# EasyEDA Pro project LTC1569.eprj

# Schematic Schematic1
Board Name: Board1; Create Date: 2025-04-03; Page Name: P1; Project Name: LTC1569; Schematic Name: Schematic1; Update Date: 2025-04-23; Company: 嘉立创EDA; Page Size: A4; Version: V1.0
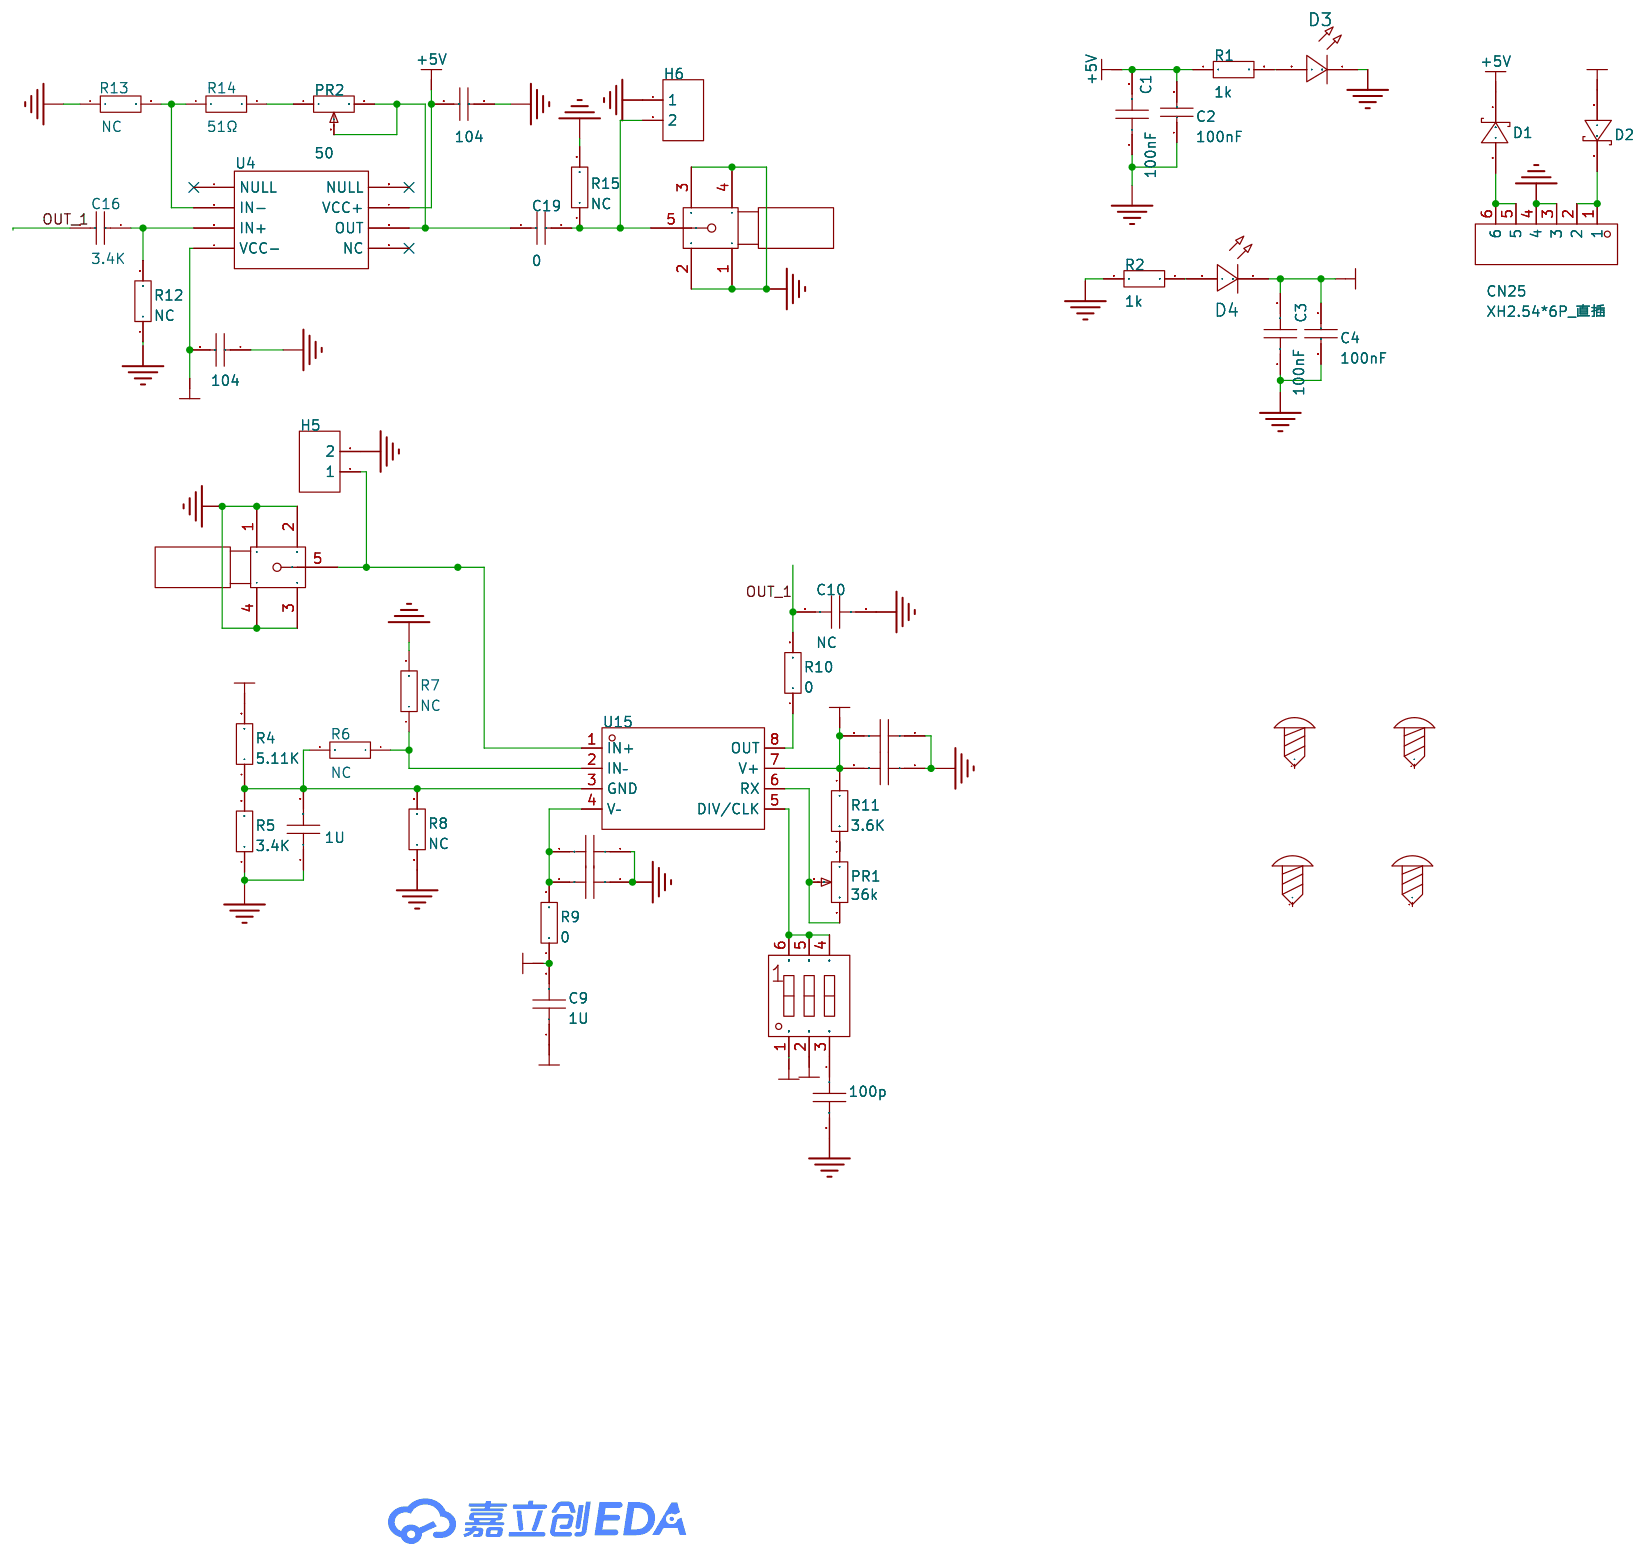
[diagram p0: schematic sheet]

## Parts
C1  100nF  [R0805]
C2  100nF  [C1210]
C3  100nF  [R0805]
C4  100nF  [C1210]
C6  1U  [R0805]
C7  100nF  [R0805]
C8  100nF  [R0805]
C9  1U  [R0805]
C10  NC  [R0805]
C11  100nF  [R0805]
C12  100nF  [R0805]
C14  100p  [R0805]
C16  3.4K  [R0805]
C17  104  [R0805]
C18  104  [R0805]
C19  0  [R0805]
CN25  XH2.54*6P_直插  [CONN-TH_XH2.54-6P]
D1  SD103AWS  [SOD-323_L1.8-W1.3-LS2.5-RD]
D2  SD103AWS  [SOD-323_L1.8-W1.3-LS2.5-RD]
D3  -  [LED_0805]
D4  -  [LED_0805]
H5  -  [HDR-TH_2P-P2.54-V-F]
H6  -  [HDR-TH_2P-P2.54-V-F]
PR1  36k  [R_3296]
PR2  50  [R_3296]
R1  1k  [R0805]
R2  1k  [R0805]
R4  5.11K  [R0805]
R5  3.4K  [R0805]
R6  NC  [R0805]
R7  NC  [R0805]
R8  NC  [R0805]
R9  0  [R0805]
R10  0  [R0805]
R11  3.6K  [R0805]
R12  NC  [R0805]
R13  NC  [R0805]
R14  51Ω  [R0805]
R15  NC  [R0805]
SCREW9  -  [M3螺丝]
SCREW10  -  [M3螺丝]
SCREW11  -  [M3螺丝]
SCREW12  -  [M3螺丝]
SW1  DSIC03LS-P  [SW-SMD_6P-L8.6-W6.2-P2.54-LS9.8]
U4  -  [THS4001CD]
U15  LTC1569IS8-6#TRPBF  [SO-8_L4.9-W3.9-P1.27-LS6.0-BL]
U16  -  [SMA]
U17  -  [SMA]

## Library data of the parts
C1 C3 C6-C12 C14 = CAP_0805: Supplier Footprint: 0805
C2 C4 = CL32B106KAJNNNE: 容值:10uF;精度:±10%;额定电压:25V;材质(温度系数):X7R;; LCSC Part Name: 10uF ±10% 25V; Supplier Part: C39232; Manufacturer: SAMSUNG(三星); Supplier Footprint: 1210; JLCPCB Part Class: 扩展库; Datasheet: https://atta.szlcsc.com/upload/public/pdf/source/20160218/1457707763339.pdf; Supplier: LCSC; Tolerance: ±10%; Voltage Rated: 25V; Temperature Coefficient: X7R
C16-C19 = CL21C101JBANNNC: 容值:100pF;精度:±5%;额定电压:50V;材质(温度系数):C0G;; LCSC Part Name: 100pF ±5% 50V; Supplier Part: C1790; Manufacturer: SAMSUNG(三星); Supplier Footprint: 0805; JLCPCB Part Class: 基础库; Datasheet: https://atta.szlcsc.com/upload/public/pdf/source/20160218/1457707763339.pdf; Supplier: LCSC; Tolerance: ±5%; Voltage Rated: 50V; Temperature Coefficient: C0G
CN25 = XH2.54*6P_直插: Supplier Part: C9900008614; Supplier Footprint: XH2.54_6P; JLCPCB Part Class: 扩展库; Supplier: LCSC
D1 D2 = SD103AWS_C181207: 正向压降(Vf):600mV@200mA;直流反向耐压(Vr):40V;整流电流:350mA;; LCSC Part Name: 电压:40V 电流:350mA 丝印S4; Supplier Part: C181207; Manufacturer: Hottech(合科泰); Supplier Footprint: SOD-323; JLCPCB Part Class: 扩展库; Datasheet: https://atta.szlcsc.com/upload/public/pdf/source/20240513/4691873FBB9173EFBCF4C6FD4BBA1025.pdf; Supplier: LCSC; Forward Voltage (Vf@If): 600mV@200mA; Reverse Voltage (Vr): 40V; Rectified Current: 350mA
D3 D4 = LED_0805-R: Supplier Footprint: 0805
H5 H6 = HDR-F_2.54_1x2P: Supplier Part: C49661; Supplier Footprint: 插件
PR1 PR2 = R_3296: Supplier Footprint: 直插
R1 R2 R4-R11 = Res_0805: Supplier Footprint: 0805
R12 R13 R15 = 0805W8F510JT5E: 电阻类型:厚膜电阻;阻值:51Ω;精度:±1%;功率:125mW;最大工作电压:150V;温度系数:±100ppm/℃;; LCSC Part Name: 51Ω ±1% 125mW 厚膜电阻; Supplier Part: C17738; Manufacturer: UNI-ROYAL(厚声); Supplier Footprint: 0805; JLCPCB Part Class: 基础库; Datasheet: https://atta.szlcsc.com/upload/public/pdf/source/20200306/C422600_1E6D84923E4A46A82E41ADD87F860B5C.pdf; Supplier: LCSC; Type: 厚膜电阻; Tolerance: ±1%; Power(Watts): 125mW; Overload Voltage (Max): 150V; Temperature Coefficient: ±100ppm/℃; Operating Temperature Range: -55℃~+155℃
R14 = 0805W8F5110T5E: 电阻类型:厚膜电阻;阻值:511Ω;精度:±1%;功率:125mW;最大工作电压:150V;温度系数:±100ppm/℃;; LCSC Part Name: 511Ω ±1% 125mW 厚膜电阻; Supplier Part: C17736; Manufacturer: UNI-ROYAL(厚声); Supplier Footprint: 0805; JLCPCB Part Class: 扩展库; Datasheet: https://atta.szlcsc.com/upload/public/pdf/source/20200306/C422600_1E6D84923E4A46A82E41ADD87F860B5C.pdf; Supplier: LCSC; Type: 厚膜电阻; Tolerance: ±1%; Power(Watts): 125mW; Overload Voltage (Max): 150V; Temperature Coefficient: ±100ppm/℃; Operating Temperature Range: -55℃~+155℃
SCREW9-SCREW12 = M3螺丝: Supplier Footprint: 插件
SW1 = DSIC03LS-P: 类型:平拨,凸起式;电路结构:单刀单掷;开关位数:3位;额定电流:25mA;额定电压:24V;使用寿命:3千次;颜色:黑色;; LCSC Part Name: 间距2.54mm 平拨,凸起式 3位拨码开关; Supplier Part: C319040; Manufacturer: XKB Connectivity(中国星坤); Supplier Footprint: SMD-6P,6x7.6mm; JLCPCB Part Class: 扩展库; Datasheet: https://atta.szlcsc.com/upload/public/pdf/source/20211009/004AD184124B4CBFBB0B4AFFEA8A3CC9.pdf; Supplier: LCSC; Type: 平拨,凸起式; Circuit: 单刀单掷; Number of Positions: 3位; Pin Style: 鸥翼型; Lead Pitch: 2.54mm; Current Rating: 25mA; Voltage Rating: 24V; Operating Temperature: -20℃~+70℃; Operating Life: 3千次; Color: 黑色
U4 = THS4001CD
U15 = LTC1569IS8-6#TRPBF: 滤波器阶数:10;滤波器数:1;; LCSC Part Name: 线性相位、DC 准确、低功率、10 阶低通滤波器; Supplier Part: C675988; Manufacturer: ADI(亚德诺); Supplier Footprint: SO-8; JLCPCB Part Class: 扩展库; Datasheet: https://atta.szlcsc.com/upload/public/pdf/source/20210331/C580405_6CF07DDBD67FDDBD7A3878E8E00EC1F0.pdf; Supplier: LCSC; Filter Order: 10; Number of Filters: 1
U16 U17 = SMA

## Nets
+5V: C1.2 C2.2 C9.1 C11.2 C12.2 C18.2 D1.1(C) R1.1 R4.2 R11.1 SW1.1(PIN1) U4.7(VCC+) U15.7(V+)
-5V: C3.2 C4.2 C9.2 C17.2 D2.2(A) D4.1(C) R9.1 SW1.2(PIN2) U4.4(VCC-)
GND: C1.1 C2.1 C3.1 C4.1 C6.1 C7.1 C8.1 C10.1 C11.1 C12.1 C14.2 C17.1 C18.1 CN25.3 CN25.4 D3.1(C) H5.2 H6.1 R2.1 R5.1 R7.2 R8.1 R12.1 R13.1 R15.2 U16.1 U16.2 U16.3 U16.4 U17.1 U17.2 U17.3 U17.4
OUT_1: C10.2 C16.1 R10.2
$1N1578: C19.1 PR2.2 PR2.3 U4.6(OUT)
$1N1580: C19.2 H6.2 R15.1 U17.5
$1N1597: PR1.1 R11.2
$1N1598: PR1.2 PR1.3 U15.6(RX)
$1N1616: R10.1 U15.8(OUT)
$1N1618: R13.2 R14.1 U4.2(IN-)
$1N1622: C16.2 R12.2 U4.3(IN+)
$1N1624: PR2.1 R14.2
$1N2087: CN25.5 CN25.6 D1.2(A)
$1N2089: CN25.1 CN25.2 D2.1(C)
$1N2093: D3.2(A) R1.2
$1N2095: D4.2(A) R2.2
$1N3128: R6.1 R7.1 U15.2(IN–)
$1N3131: C6.2 R4.1 R5.2 R6.2 R8.2 U15.3(GND)
$1N3188: H5.1 U15.1(IN+) U16.5
$1N3587: SW1.4(PIN4) SW1.5(PIN5) SW1.6(PIN6) U15.5(DIV/CLK)
$1N4762: C7.2 C8.2 R9.2 U15.4(V–)
$1N4812: C14.1 SW1.3(PIN3)

Not connected (* = marked no-connect by the designer): SCREW9 1; SCREW10 1; SCREW11 1; SCREW12 1; U4 1(NULL)* 5(NC)* 8(NULL)*

# Board PCB1
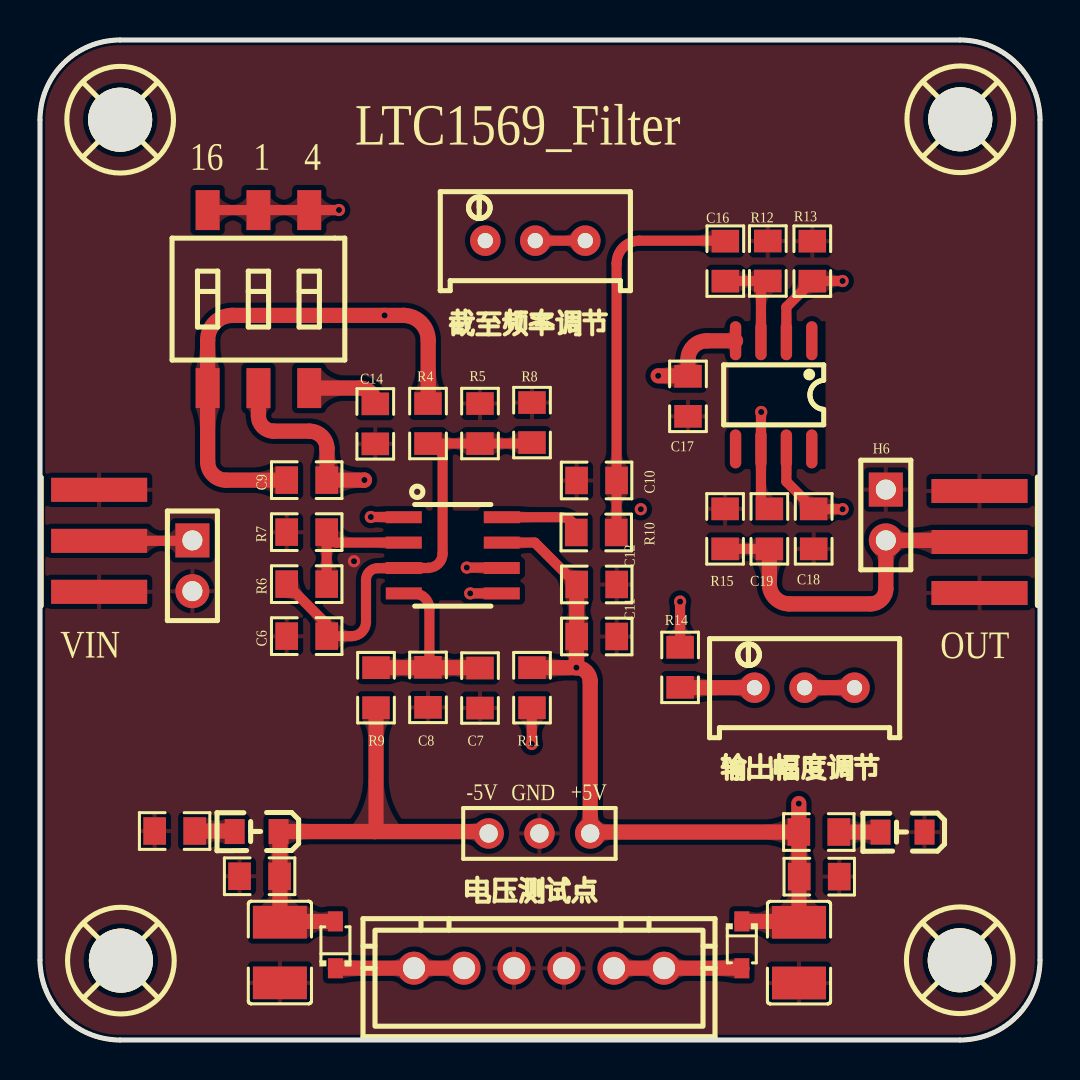
[diagram p1: board, top side]
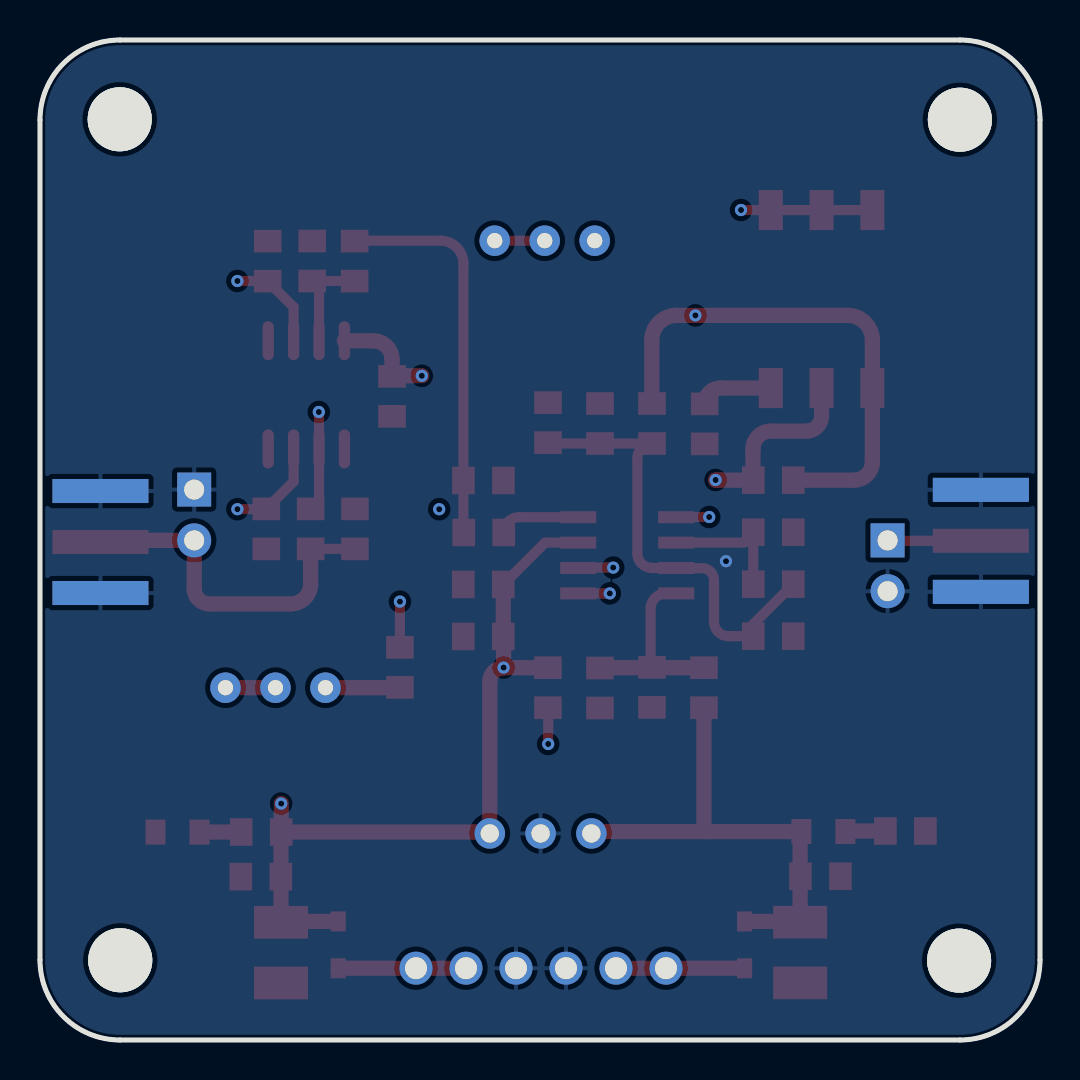
[diagram p2: board, bottom side, seen from below]

Outline 50 x 50 mm; copper layers: Top Layer, Inner1, Inner2, Bottom Layer. Coordinates in mm from the lower left corner of the outline.
Outline path: 0,46 0,4 arc(1.17,1.17) 4,0 46,0 arc(48.83,1.17) 50,4 50,46 arc(48.83,48.83) 46,50 4,50 arc(1.17,48.83) 0,46
Stack: Top Layer 0.035mm 外层铜厚1oz / Dielectric1 0.2104mm 7628 RC49% 8.6mil / Inner1 0.0152mm 内层铜厚 / Dielectric2 1.065mm 1.1mm H/HOZ Copper / Inner2 0.0152mm 内层铜厚 / Dielectric3 0.2104mm 7628 RC49% 8.6mil / Bottom Layer 0.035mm 外层铜厚1oz

## Design rules (mm)
template: 自定义配置
spacing copperThickness1oz (default): track to track 0.102, other pairs 0.152 to 0.3
spacing copperThickness2oz: track to track 0.203, other pairs 0.152 to 0.3
track width copperThickness1oz (default): min 0.127, default 0.508, max 2.54
track width copperThickness2oz: min 0.203, default 0.254, max 2.54
differential pair differentialPair (default): width min 0.127, default 0.254, max 2.54; gap min 0.152, default 0.152
via viaSize (default): diameter min 0.5, default 0.61, max 10; hole min 0.3, default 0.305, max 6.3

## Placement (name value [footprint] x y rotation side)
C1  100nF  [R0805#2]  38.85 8.17 180 top
C2  100nF  [C1210]  37.95 4.37 90 top
C3  100nF  [R0805#2]  11.09 8.19 0 top
C4  100nF  [C1210]  12 4.37 90 top
C6  1U  [R0805#2]  13.45 20.19 0 top
C7  100nF  [R0805#2]  22 17.71 90 top
C8  100nF  [R0805#2]  19.4 17.74 90 top
C9  1U  [R0805#2]  13.45 27.99 0 top
C10  NC  [R0805#2]  27.94 27.98 0 top
C11  100nF  [R0805#2]  27.72 20.18 180 top
C12  100nF  [R0805#2]  27.72 22.78 180 top
C14  100p  [R0805#2]  16.76 30.7 270 top
C16  3.4K  [R0805#2]  34.27 38.83 270 top
C17  104  [R0805#2]  32.4 32.29 90 top
C18  104  [R0805#2]  38.68 25.67 90 top
C19  0  [R0805#2]  36.47 25.45 270 top
CN25  XH2.54*6P_直插  [CONN-TH_XH2.54-6P]  24.95 3.59 0 top
D1  SD103AWS  [SOD-323_L1.8-W1.3-LS2.5-RD]  35.09 4.76 270 top
D2  SD103AWS  [SOD-323_L1.8-W1.3-LS2.5-RD]  14.77 4.76 90 top
D3  -  [LED_0805]  43.08 10.4 180 top
D4  -  [LED_0805]  10.78 10.43 180 top
H5  -  [HDR-TH_2P-P2.54-V-F]  7.62 23.71 270 top
H6  -  [HDR-TH_2P-P2.54-V-F]  42.29 26.25 270 top
NOREF  -  [Pad_e1113]  22.43 10.33 0 top
NOREF#2  -  [Pad_e1116]  27.51 10.33 0 top
NOREF#3  -  [Pad_e1114]  24.97 10.33 0 top
PR1  36k  [R_3296]  24.76 40.09 0 top
PR2  50  [R_3296]  38.23 17.74 0 top
R1  1k  [R0805]  38.94 10.4 0 top
R2  1k  [R0805]  6.73 10.45 0 top
R4  5.11K  [R0805]  19.4 30.82 90 top
R5  3.4K  [R0805]  22 30.82 270 top
R6  NC  [R0805]  13.34 22.79 180 top
R7  NC  [R0805]  13.34 25.39 180 top
R8  NC  [R0805]  24.6 30.87 270 top
R9  0  [R0805]  16.8 17.61 90 top
R10  0  [R0805]  27.81 25.38 0 top
R11  3.6K  [R0805]  24.6 17.61 270 top
R12  NC  [R0805]  36.39 38.95 270 top
R13  NC  [R0805]  38.61 38.94 270 top
R14  51Ω  [R0805]  32 18.63 270 top
R15  NC  [R0805]  34.25 25.56 90 top
SCREW9  -  [M3螺丝]  4.01 46.01 0 top
SCREW10  -  [M3螺丝]  46.01 46.04 0 top
SCREW11  -  [M3螺丝]  4.04 3.97 0 top
SCREW12  -  [M3螺丝]  45.99 3.99 0 top
SW1  DSIC03LS-P  [SW-SMD_6P-L8.6-W6.2-P2.54-LS9.8]  10.92 37.05 0 top
U4  -  [THS4001CD]  36.08 32.16 270 top
U15  LTC1569IS8-6#TRPBF  [SO-8_L4.9-W3.9-P1.27-LS6.0-BL]  20.64 24.23 270 top
U16  -  [SMA]  -0.85 19.1 0 top
U17  -  [SMA]  50.79 30.76 180 top

## Footprints (pads in the part's own frame, mm; a bottom-side part is the same pattern mirrored in y, then rotated)
C1210
  rect 1.635x2.7 smd: 1(-1.518,0) 2(1.518,0)
CONN-TH_XH2.54-6P
  round 1.65 hole 1.1: 1(-6.25,0) 2(-3.75,0) 3(-1.25,0) 4(1.25,0) 5(3.75,0) 6(6.25,0)
HDR-TH_2P-P2.54-V-F
  rect 1.7x1.7 hole 1: 1(-1.27,0)
  round 1.7 hole 1: 2(1.27,0)
LED_0805
  rect 1x1.25 smd: 1(-1.15,0.005) 2(1.05,0.005)
M3螺丝
  round 3.2 hole 3.2: 1(0,0)
Pad_e1113
  round 1.524 hole 0.914: 1(0,0)
Pad_e1114
  round 1.524 hole 0.914: 2(0,0)
Pad_e1116
  round 1.524 hole 0.914: 3(0,0)
R0805
  rect 1.133x1.377 smd: 1(-1,0) 2(1,0)
R0805#2
  rect 1.133x1.377 smd: 1(-1.111,0) 2(0.889,0)
R_3296
  round 1.524 hole 0.762: 1(-2.499,-0.127) 2(0,-0.127) 3(2.499,-0.127)
SMA
  rect 4.8x1.2 smd: 1(3.81,8.412) 2(3.81,3.312) 5(3.81,5.862)
  rect 4.8x1.2 smd far side: 3(3.81,3.312) 4(3.81,8.412)
SO-8_L4.9-W3.9-P1.27-LS6.0-BL
  rect 0.6x1.8 smd: 1(-1.905,-2.45) 2(-0.635,-2.45) 3(0.635,-2.45) 4(1.905,-2.45) 5(1.905,2.45) 6(0.635,2.45) 7(-0.635,2.45) 8(-1.905,2.45)
SOD-323_L1.8-W1.3-LS2.5-RD
  rect 1x0.75 smd: 1(-1.173,0) 2(1.173,0)
SW-SMD_6P-L8.6-W6.2-P2.54-LS9.8
  rect 1.2x2 smd: 1(-2.54,-4.45) 2(0,-4.45) 3(2.54,-4.45) 4(2.54,4.45) 5(0,4.45) 6(-2.54,4.45)
THS4001CD
  oval 1.95x0.569 smd: 1(-2.804,2.51) 2(-2.804,1.24) 3(-2.804,-0.029) 4(-2.804,-1.3) 5(2.606,-1.3) 6(2.606,-0.029) 7(2.606,1.24) 8(2.606,2.51)

## Nets
As in the schematic, except:
+5V: C1.2 C2.2 C9.1 C11.2 C12.2 C18.2 D1.1 NOREF#2.3 R1.1 R4.2 R11.1 SW1.1 U4.7 U15.7
-5V: C3.2 C4.2 C9.2 C17.2 D2.2 D4.1 NOREF.1 R9.1 SW1.2 U4.4
GND: C1.1 C2.1 C3.1 C4.1 C6.1 C7.1 C8.1 C10.1 C11.1 C12.1 C14.2 C17.1 C18.1 CN25.3 CN25.4 D3.1 H5.2 H6.1 NOREF#3.2 R2.1 R5.1 R7.2 R8.1 R12.1 R13.1 R15.2 U16.1 U16.2 U16.3 U16.4 U17.1 U17.2 U17.3 U17.4

Pads without a net: SCREW9 1; SCREW10 1; SCREW11 1; SCREW12 1; U4 1 5 8

## Via types
v1: diameter 0.61, hole 0.305, Top Layer to Bottom Layer, 16 vias

## Routing (per net, layer and track width the routed paths; a pad name or vN(x,y) marks a point on that pad's centre or on a via; arc(x,y) is an arc through that point)
+5V: length 126
  Top Layer w0.508: 37.32,29.55 37.32,27.92 C18.2 arc(38.69,26.54) 38.7,26.54 v1(40.13,26.54) ; U15.7 24.74,24.87 C12.2
  Top Layer w0.762: R11.1 26.81,18.61 arc(26.82,18.62) v1(26.82,18.62) ; C9.1 9.31,27.99 arc(8.65,28.26) 8.38,28.92 SW1.1 8.38,34.99 arc(8.74,35.87) 9.62,36.23 v1(17.23,36.23) 18.17,36.23 arc(19.05,35.87) 19.41,34.99 19.41,31.83 arc(19.41,31.83) R4.2 ; v1(26.82,18.62) 26.82,20.16 arc(26.82,20.17) C11.2 C12.2 ; v1(26.82,18.62) arc(27.31,18.42) 27.51,17.93 27.51,10.33 ; D1.1 37.91,5.93 arc(37.94,5.92) 37.95,5.89 37.95,10.39 arc(37.95,10.4) R1.1 ; R1.1 27.58,10.4 arc(27.53,10.38) NOREF#2.3 ; R1.1 v1(37.94,11.82)
  Inner1 w0.762: v1(40.13,26.54) v1(30.04,26.54)
  Inner2 w0.762: v1(17.23,36.23) 17.23,41.65 arc(17.62,42.6) 18.57,42.99 29.01,42.99 arc(29.76,42.68) 30.07,41.93 30.07,19.77 arc(29.73,18.96) 28.92,18.62 v1(26.82,18.62)
-5V: length 81.1
  Top Layer w0.762: D2.2 12.03,5.93 arc(12.01,5.92) C4.2 12,10.36 arc(11.98,10.4) 11.93,10.42 16.74,10.42 ; 16.74,10.42 22.34,10.42 arc(22.4,10.39) NOREF.1 ; 16.74,10.42 arc(16.78,10.44) 16.8,10.48 R9.1 ; 34.78,34.96 33.34,34.96 arc(32.67,34.68) 32.4,34.02 C17.2 arc(32.39,33.2) 32.37,33.21 v1(30.91,33.21) ; SW1.2 10.92,31.2 arc(11.15,30.67) 11.68,30.44 13.46,30.44 arc(14.09,30.18) 14.35,29.55 14.35,28.01 arc(14.35,28) C9.2 16.21,27.99 arc(16.22,27.99) v1(16.22,28)
  Inner1 w0.762: v1(30.91,33.21) 17.7,33.21 arc(16.65,32.78) 16.22,31.73 v1(16.22,28) 20.88,28 arc(21.99,27.54) 22.45,26.43 22.45,10.35 arc(22.44,10.33) NOREF.1
GND:
  vias: v1(15.7,23.94)
OUT_1: length 19.6
  Top Layer w0.508: R10.2 arc(28.82,25.38) 28.83,25.39 C10.2 28.83,38.82 arc(29.16,39.63) 29.97,39.97 34.24,39.97 arc(34.26,39.96) C16.1
$1N1578: length 23.4
  Top Layer w0.508: C19.1 arc(36.17,26.68) 36.05,26.98 U4.6 36.05,31.39 arc(36.05,31.4) v1(36.06,31.4)
  Top Layer w0.762: PR2.2 PR2.3
  Inner2 w0.508: v1(36.06,31.4) 37.71,31.4 arc(38.11,31.24) 38.27,30.84 38.27,17.66 arc(38.26,17.63) PR2.2
$1N1580: length 17.9
  Top Layer w0.508: C19.2 R15.1
  Top Layer w0.762: C19.2 36.47,22.8 arc(36.76,22.1) 37.47,21.81 41.53,21.81 arc(42.07,22.03) 42.29,22.57 42.29,24.98 46.9,24.98 arc(46.95,24.96) U17.5
$1N1597: length 32.3
  Top Layer w0.508: v1(24.59,14.8) 24.59,16.6 arc(24.59,16.61) R11.2
  Inner2 w0.508: v1(24.59,14.8) 21.35,14.8 arc(20.61,15.11) 20.3,15.85 20.3,38.93 arc(20.6,39.64) 21.31,39.94 22.24,39.94 arc(22.26,39.95) PR1.1
$1N1598: length 26.1
  Top Layer w0.508: PR1.3 PR1.2 ; 23.09,23.6 23.07,23.62 v1(21.34,23.62)
  Inner2 w0.508: v1(21.34,23.62) 26.04,23.62 26.07,23.59 arc(26.91,23.94) 27.26,24.78 PR1.3
$1N1616: length 4.2
  Top Layer w0.508: U15.8 26.05,26.14 arc(26.59,25.92) R10.1
$1N1618: length 30.8
  Top Layer w0.508: v1(40.13,37.95) 38.62,37.95 arc(38.62,37.95) R13.2 37.32,36.65 37.32,34.96 ; R14.1 v1(32,21.92)
  Inner2 w0.508: v1(40.13,37.95) 33.63,37.95 arc(32.48,37.47) 32,36.32 v1(32,21.92)
$1N1622: length 5.3
  Top Layer w0.508: 34.27,37.95 R12.2 arc(36.15,37.85) 36.05,37.61 U4.3 ; 36.81,38.2 arc(36.81,38.2) 36.81,38.2
$1N1624: length 3.7
  Top Layer w0.762: PR2.1 32.02,17.61 arc(32.01,17.62) R14.2
$1N2087: length 6.4
  Top Layer w0.762: CN25.5 CN25.6 35.09,3.59 arc(35.09,3.59) 35.09,3.58
$1N2089: length 6.4
  Top Layer w0.762: CN25.2 CN25.1 14.78,3.59 arc(14.77,3.59) 14.77,3.58
$1N2093: length 2.1
  Top Layer w0.762: R1.2 42.02,10.4 arc(42.03,10.4) D3.2
$1N2095: length 2
  Top Layer w0.762: R2.2 9.71,10.45 arc(9.72,10.44) 9.73,10.42
$1N3128: length 6.8
  Top Layer w0.508: R6.1 R7.1 arc(14.49,25.02) 14.86,24.87 U15.2
$1N3131: length 23.6
  Top Layer w0.508: R6.2 14.34,20.79 C6.2 15.58,20.19 arc(16.09,20.4) 16.3,20.91 16.3,23 arc(16.47,23.42) 16.89,23.59 18.18,23.59 arc(18.19,23.59) 18.19,23.6 19.41,23.6 arc(19.42,23.6) 19.42,23.61 arc(19.92,23.82) 20.13,24.32 20.13,29.09 arc(19.92,29.61) R4.1 R5.2 24.55,29.82 arc(24.59,29.84) R8.2
$1N3188: length 16.2
  Top Layer w0.508: 2.96,24.96 7.6,24.96 H5.1 ; v1(16.54,26.15) 18.18,26.15 arc(18.19,26.15) U15.1
  Inner2 w0.508: v1(16.54,26.15) 8.15,26.15 arc(7.78,25.99) 7.62,25.62 H5.1
$1N3587: length 33.4
  Top Layer w0.508: SW1.6 SW1.5 SW1.4 14.95,41.5 arc(14.95,41.5) v1(14.95,41.5) ; v1(21.51,22.33) 23.09,22.33
  Inner1 w0.508: v1(14.95,41.5) 14.95,23.4 arc(15.26,22.64) 16.02,22.33 v1(21.51,22.33)
$1N4762: length 9.9
  Top Layer w0.508: U15.4 18.7,22.33 arc(19.24,22.1) 19.47,21.56 19.47,18.7 arc(19.45,18.65) C8.2
  Top Layer w0.762: R9.2 21.98,18.61 arc(22,18.61) C7.2
$1N4812: length 3.8
  Top Layer w0.762: SW1.3 15.97,32.6 arc(16.53,32.36) C14.1

## Copper pours and planes (outline as drawn; the poured copper is in the pictures)
GND on Top Layer: -5.43,57.01 56.13,57.01 56.13,-11.7 -5.43,-11.7
GND on Bottom Layer: -4.52,58.47 52.47,58.47 52.47,-14.27 -4.52,-14.27
GND on Inner1: -2.87,57.92 52.65,57.92 52.65,-10.61 -2.87,-10.61
GND on Inner2: -3.05,50.41 52.83,50.41 52.83,-7.31 -3.05,-7.31

Small or netless copper shapes (teardrops, artwork), in the pictures only: 115 on Top Layer, 3 on Inner1, 9 on Inner2

## Text on the board
Top Silkscreen Layer: -5V | GND | +5V | 电压测试点 | 截至频率调节 | 输出幅度调节 | 16 | 1 | 4 | VIN | OUT | LTC1569_Filter
